# Altium schematic sheet block_diagram.SchDoc: Block Diagram
size B; Organization: Altium Limited; Address1: L3, 12a Rodborough Rd; Address2: Frenchs Forest; Address3: NSW; Address4: Australia 2086; Revision: A; SheetNumber: 2; SheetTotal: 7
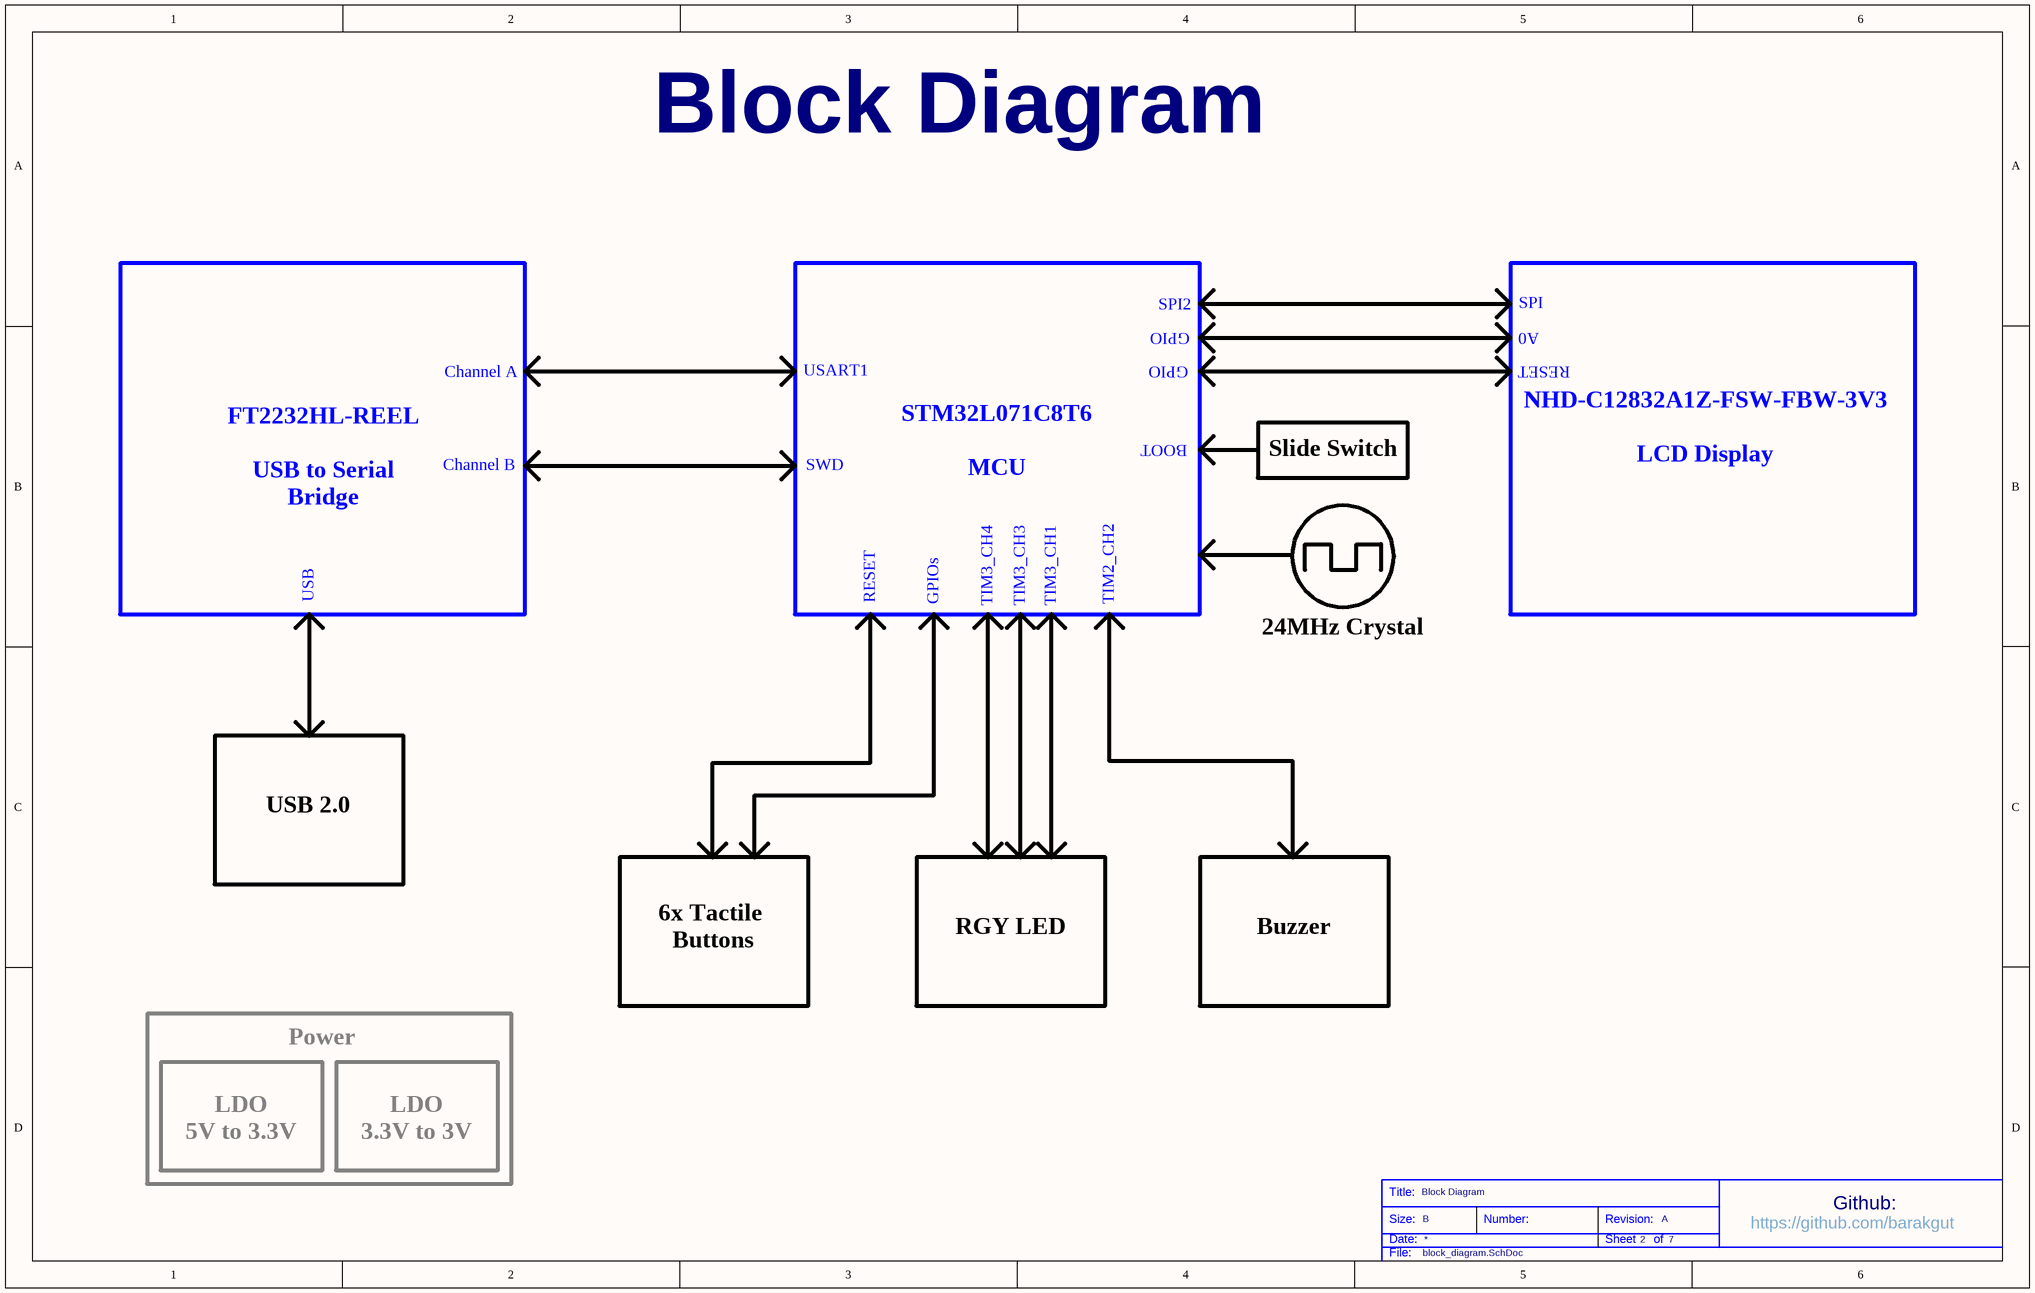
[diagram p0: block_diagram.SchDoc]

## Notes on the sheet
- Block Diagram
- SPI2
- GPIO
- SPI
- A0
- RESET
- Channel A
- USART1
- BOOT
- Channel B
- SWD
- STM32L071C8T6
  MCU
- Slide Switch
- NHD-C12832A1Z-FSW-FBW-3V3
  LCD Display
- FT2232HL-REEL
  USB to Serial Bridge
- USB
- GPIOs
- TIM3_CH4
- TIM3_CH3
- TIM3_CH1
- TIM2_CH2
- 24MHz Crystal
- USB 2.0
- 6x Tactile
  Buttons
- RGY LED
- Buzzer
- Power
- LDO
  5V to 3.3V
- LDO
  3.3V to 3V
- Title:
- Size:
- Date:
- B
- Number:
- Revision:
- Sheet
- of
- https://github.com/barakgut
- Github:
- File: